# Altium schematic sheet MCU.SchDoc
size A3; SheetNumber: 3; SheetTotal: 4
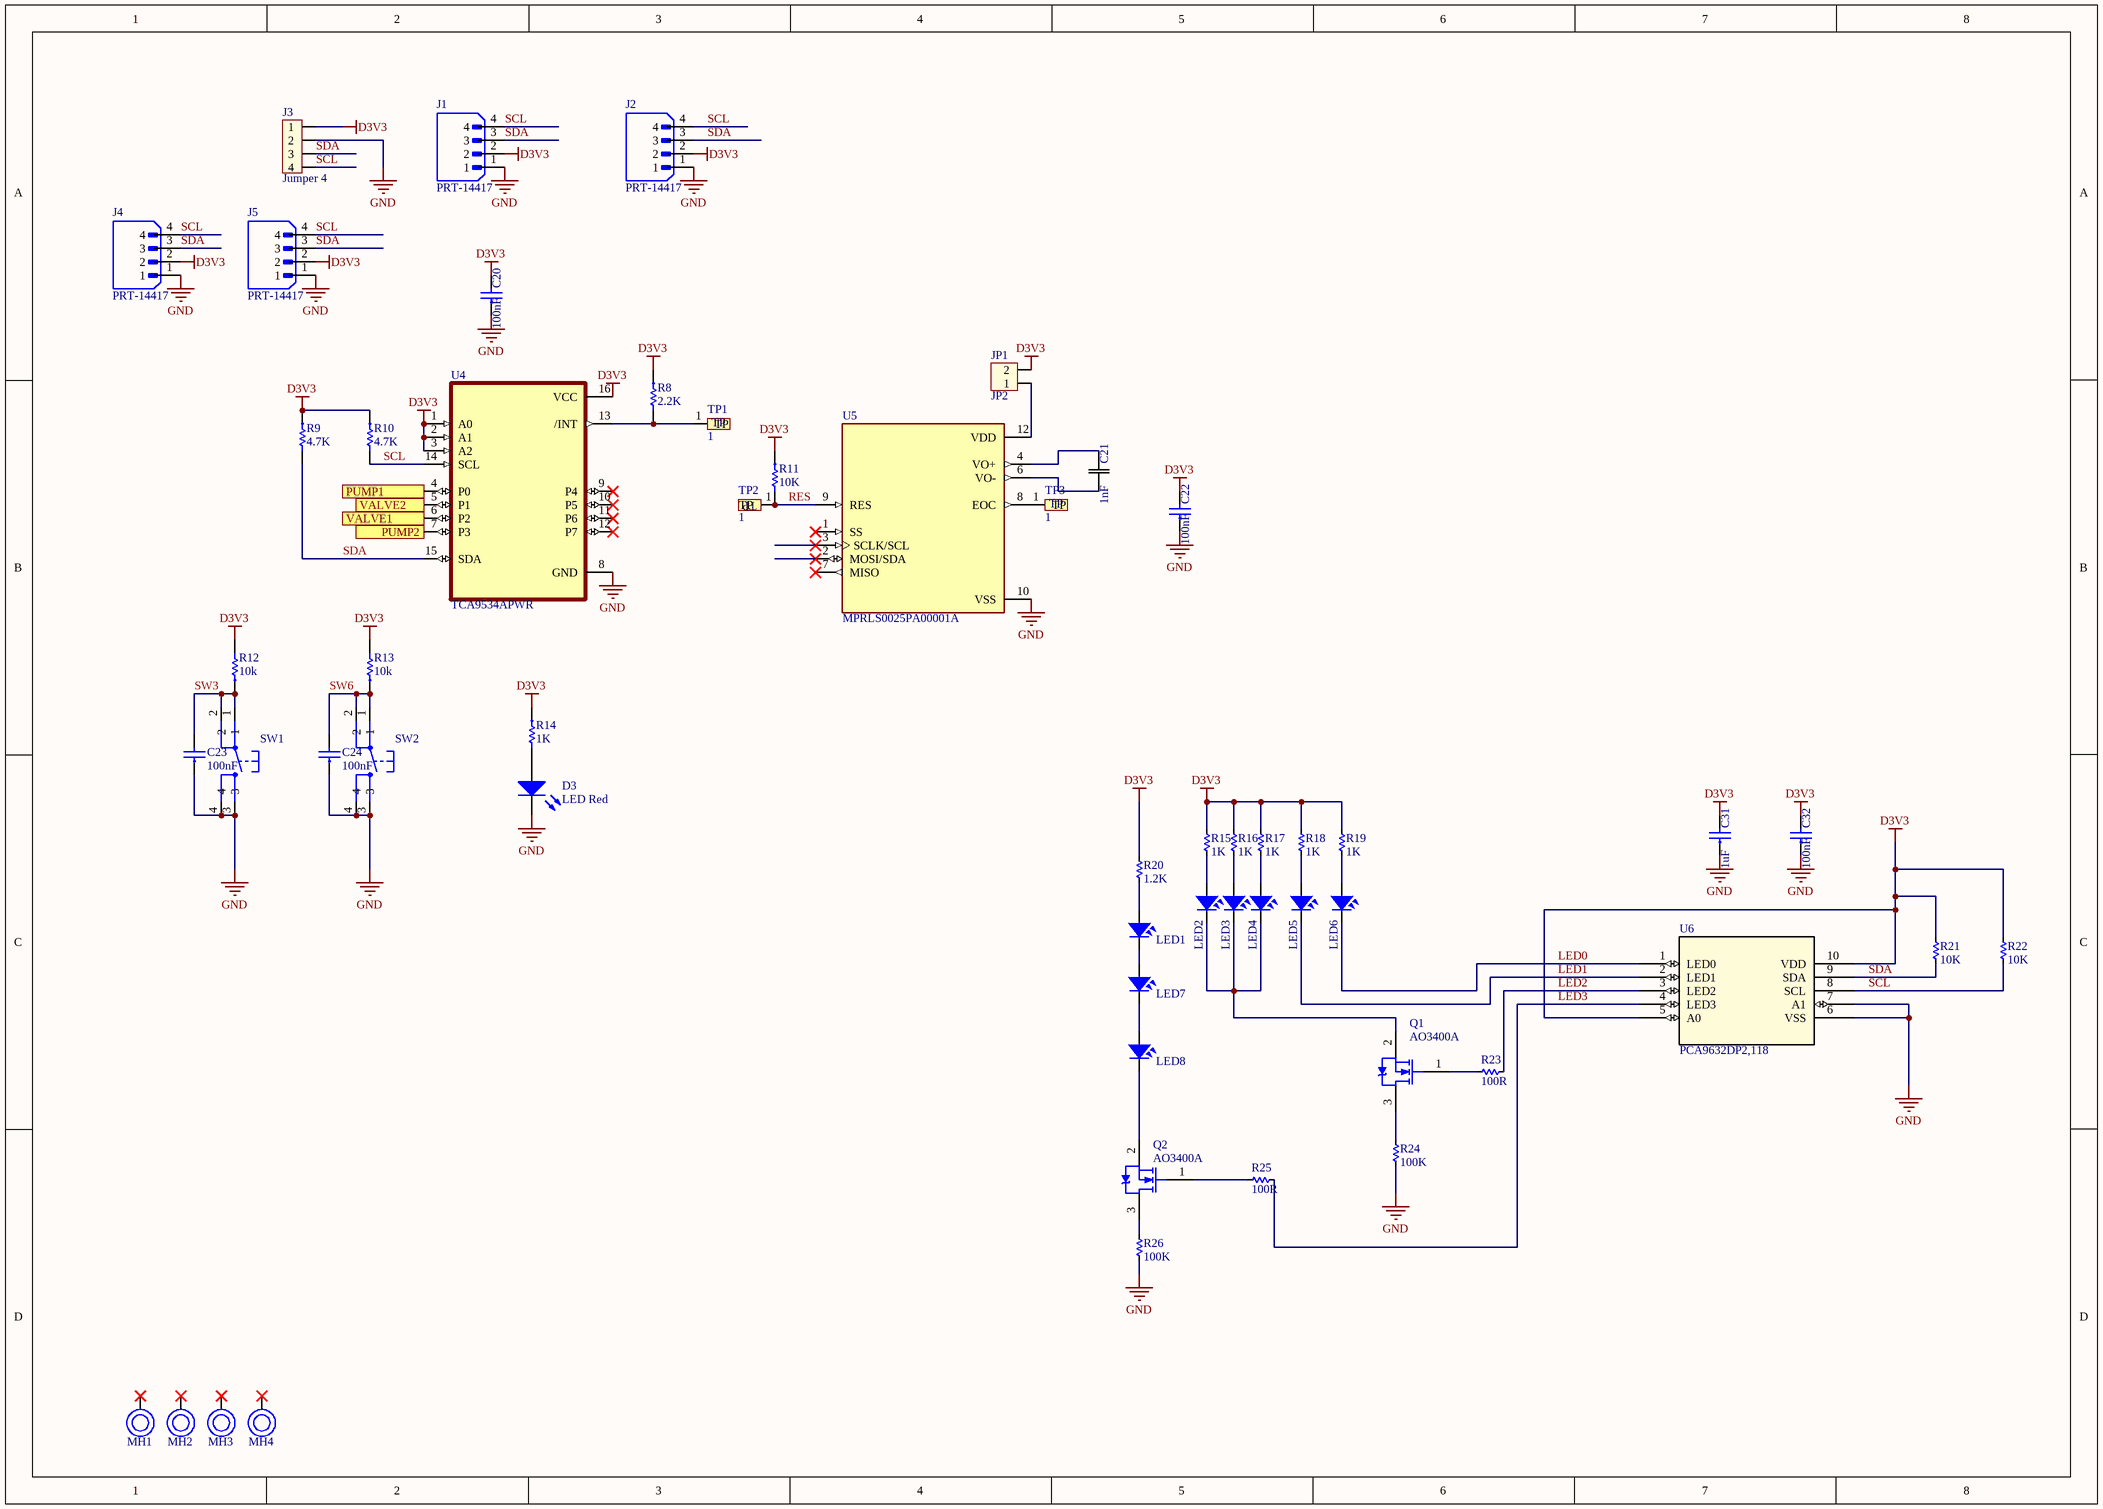
[diagram p0: MCU.SchDoc]

## Parts
C20  100nF  [CN-SMD-0603]
C21  1nF  [CN-SMD-0603]
C22  100nF  [CAP_CL10_SAM-L]
C23  100nF  [CN-SMD-0603]
C24  100nF  [CN-SMD-0603]
C31  1uF  [CAP_CL10_SAM-L]
C32  100nF  [CAP_CL10_SAM-L]
D3  LED Red  [LED-0805-Red]
J1  PRT-14417  [SPARKFUN_PRT-14417]
J2  PRT-14417  [SPARKFUN_PRT-14417]
J3  Jumper 4  [JP4]
J4  PRT-14417  [SPARKFUN_PRT-14417]
J5  PRT-14417  [SPARKFUN_PRT-14417]
JP1  JP2  [JP2-CLOSED]
LED1  LED  [LED-1206-Red]  (value not drawn)
LED2  LED  [LED-1206-Red]  (value not drawn)
LED3  LED  [LED-1206-Red]  (value not drawn)
LED4  LED  [LED-1206-Red]  (value not drawn)
LED5  LED  [LED-1206-Red]  (value not drawn)
LED6  LED  [LED-1206-Red]  (value not drawn)
LED7  LED  [LED-1206-Red]  (value not drawn)
LED8  LED  [LED-1206-Red]  (value not drawn)
MH1  MOUNTING HOLE  (value not drawn)
MH2  MOUNTING HOLE  (value not drawn)
MH3  MOUNTING HOLE  (value not drawn)
MH4  MOUNTING HOLE  (value not drawn)
Q1  AO3400A  [SOT-23-3L_AOS-L]
Q2  AO3400A  [SOT-23-3L_AOS-L]
R8  2.2K  [RES-SMD-0603]
R9  4.7K  [RES-SMD-0603]
R10  4.7K  [RES-SMD-0603]
R11  10K  [RES-SMD-0603]
R12  10k  [RES-SMD-0603]
R13  10k  [RES-SMD-0603]
R14  1K  [RES-SMD-0603]
R15  1K  [RES-SMD-0603]
R16  1K  [RES-SMD-0603]
R17  1K  [RES-SMD-0603]
R18  1K  [RES-SMD-0603]
R19  1K  [RES-SMD-0603]
R20  1.2K  [RES-SMD-0603]
R21  10K  [RES-SMD-0603]
R22  10K  [RES-SMD-0603]
R23  100R  [RES-SMD-0603]
R24  100K  [RES-SMD-0603]
R25  100R  [RES-SMD-0603]
R26  100K  [RES-SMD-0603]
SW1  SW2  [BUTTON 4 PIN]  (value not drawn)
SW2  SW2  [BUTTON 4 PIN]  (value not drawn)
TP1  1  [TP - 2]
TP2  1  [TP - 2]
TP3  1  [TP - 2]
U4  TCA9534APWR  [SOP65P640X120-16N]
U5  MPRLS0025PA00001A  [XDCR_MPRLS0025PA00001A]
U6  PCA9632DP2,118  [TSSOP10_3P1X3P1_NXP]

## Ports
PUMP1 (out), PUMP2 (out), VALVE1 (out), VALVE2 (out)

## Nets
D3V3: C20.2 C22.2 C31.2 C32.2 J1.2 J2.2 J3.1 J4.2 J5.2 JP1.2 R8.1 R9.1 R10.1 R11.1 R12.2 R13.2 R14.1 R15.1 R16.1 R17.1 R18.1 R19.1 R20.1 R21.1 R22.1 U4.1(A0) U4.2(A1) U4.3(A2) U4.16(VCC) U6.5(A0) U6.10(VDD)
GND: C20.1 C22.1 C23.1 C24.1 C31.1 C32.1 D3.2(K) J1.1 J2.1 J3.2 J4.1 J5.1 R24.2 R26.2 SW1.3 SW1.4 SW2.3 SW2.4 U4.8(GND) U5.10(VSS) U6.6(VSS) U6.7(A1)
LED0: LED6.2 U6.1(LED0)
LED1: LED5.2 U6.2(LED1)
LED2: R23.2 U6.3(LED2)
LED3: R25.1 U6.4(LED3)
PUMP1: U4.4(P0) ; port PUMP1
PUMP2: U4.7(P3) ; port PUMP2
RES: R11.2 TP2.1(TP) U5.9(RES)
SCL: J1.4 J2.4 J3.4 J4.4 J5.4 R10.2 R22.2 U4.14(SCL) U6.8(SCL)
SDA: J1.3 J2.3 J3.3 J4.3 J5.3 R9.2 R21.2 U4.15(SDA) U6.9(SDA)
SW3: C23.2 R12.1 SW1.1 SW1.2
SW6: C24.2 R13.1 SW2.1 SW2.2
VALVE1: U4.6(P2) ; port VALVE1
VALVE2: U4.5(P1) ; port VALVE2
NetC21_1: C21.1 U5.6(VO-)
NetC21_2: C21.2 U5.4(VO+)
NetD3_1: D3.1(A) R14.2
NetJP1_1: JP1.1 U5.12(VDD)
NetLED1_1: LED1.1 R20.2
NetLED1_2: LED1.2 LED7.1
NetLED2_1: LED2.1 R15.2
NetLED2_2: LED2.2 LED3.2 LED4.2 Q1.2(S)
NetLED3_1: LED3.1 R16.2
NetLED4_1: LED4.1 R17.2
NetLED5_1: LED5.1 R18.2
NetLED6_1: LED6.1 R19.2
NetLED7_2: LED7.2 LED8.1
NetLED8_2: LED8.2 Q2.2(S)
NetQ1_1: Q1.1(G) R23.1
NetQ1_3: Q1.3(D) R24.1
NetQ2_1: Q2.1(G) R25.2
NetQ2_3: Q2.3(D) R26.1
NetR8_2: R8.2 TP1.1(TP) U4.13(/INT)
NetTP3_1: TP3.1(TP) U5.8(EOC)

Not connected (* = marked no-connect by the designer): MH1 1(GND)*; MH2 1(GND)*; MH3 1(GND)*; MH4 1(GND)*; U4 9(P4)* 10(P5)* 11(P6)* 12(P7)*; U5 1(SS)* 2(MOSI/SDA)* 3(SCLK/SCL)* 7(MISO)*

## Library data of the parts
C20 C22-C24 C31 C32 = CAPCER0001 100nF 10% 50V X7R 0603 SMD: CAP CER 100nF 10% 50V X7R 0603 SMD; LINE: SMT; TYPE: EP; UNIT: PCS; TMG CODE: None; CERTIFICATION: NA; CLASS: B; MOUNT: SMD; TMG PN: CAPCER0001; ComponentLink1Description: Datasheet; ComponentLink1URL: https://datasheet.lcsc.com/lcsc/1811021431_Samsung-Electro-Mechanics-CL10B104KB8NNNC_C1591.pdf; Footprint: 0603
C21 = GCJ188R71H102KA01D: No Description Available; Manufacturer_Name: Murata; Type: Ceramic Capacitors; Copyright: Copyright (C) 2026 Ultra Librarian. All rights reserved.; Manufacturer_Part_Number: GCJ188R71H102KA01D
D3 = LTST-C190KRKT: Lite-On LED Red 0603; Supplier Part Number 1: 160-1436-1-ND; Supplier 1: Digi-Key; Supplier Part Number 2: FL1413; Value: LED Red
J1 J2 J4 J5 = PRT-14417: QWIIC JST CONNECTOR - SMD 4-PIN; MF: SparkFun Electronics; SnapEDA_Link: https://www.snapeda.com/parts/PRT-14417/SparkFun+Electronics/view-part/?ref=snap; Package: None; Value: *; MP: PRT-14417; Check_prices: https://www.snapeda.com/parts/PRT-14417/SparkFun+Electronics/view-part/?ref=eda
J3 = JP4: Jumper 3; Value: J3
JP1 = Con2: jumper 2.0 B; Value: Connector 2
LED1-LED8 = LED: LED Single colour Green and Red; Value: LED 3 ly Single Colour
MH1-MH4 = MH
Q1 Q2 = IRFML8244TRPBF: MOSFET N-CH 25V 5.8A SOT23; Supplier 1: Digi-Key; Supplier Part Number 1: IRFML8244TRPBFCT-ND; Value: AO3400A
R8-R14 = RESCHP0428 8K4 1% 0603 SMD: RES CHP 8K4 1% 1/10W 0603 SMD; LINE: SMT; UNIT: PCS; TMG CODE: None; CERTIFICATION: NA; CLASS: B; MOUNT: SMD; TYPE: EP; ComponentLink1Description: Datasheet; ComponentLink1URL: https://datasheet.lcsc.com/lcsc/2304140030_YAGEO-RT0603FRD07100RL_C160603.pdf
R15-R26 = Res-SMD: Resistor; Manufacturer: Generic Components; Class: Passive; Published: 08/06/2000; Publisher: Altium Hobart Technology Centre
SW1 SW2 = SW2: Switch button 4 pin
TP1-TP3 = TP: CONNECT 1
U4 = TCA9534APWR: 8-bit 1.65- to 5.5-V I2C/SMBus I/O expander with interrupt, & config registers; MF: Texas Instruments; SnapEDA_Link: https://www.snapeda.com/parts/TCA9534APWR/Texas+Instruments/view-part/?ref=snap; Package: TSSOP-16 Texas Instruments; Value: *; MP: TCA9534APWR; Check_prices: https://www.snapeda.com/parts/TCA9534APWR/Texas+Instruments/view-part/?ref=eda
U5 = MPRLS0025PA00001A: Pressure Sensor 25PSI _172.37kPa_ Absolute Male - 0.1 _2.5mm_ Tube 24 b 12-SMD Module; MF: Honeywell Sensing; MP: MPRLS0025PA00001A; SnapEDA_Link: https://www.snapeda.com/parts/MPRLS0025PA00001A/Honeywell%20Sensing%20and%20Productivity%20Solutions/view-part/2772767/?ref=snap; Digi-Key_Part_Number: 480-7098-1-ND; Package: SMD-10 Honeywell; Value: *
U6 = PCA9632DP2,118: No Description Available; Manufacturer_Name: NXP; Copyright: Copyright (C) 2026 Ultra Librarian. All rights reserved.; Manufacturer_Part_Number: PCA9632DP2,118; RefDes: RefDes; Type: Type